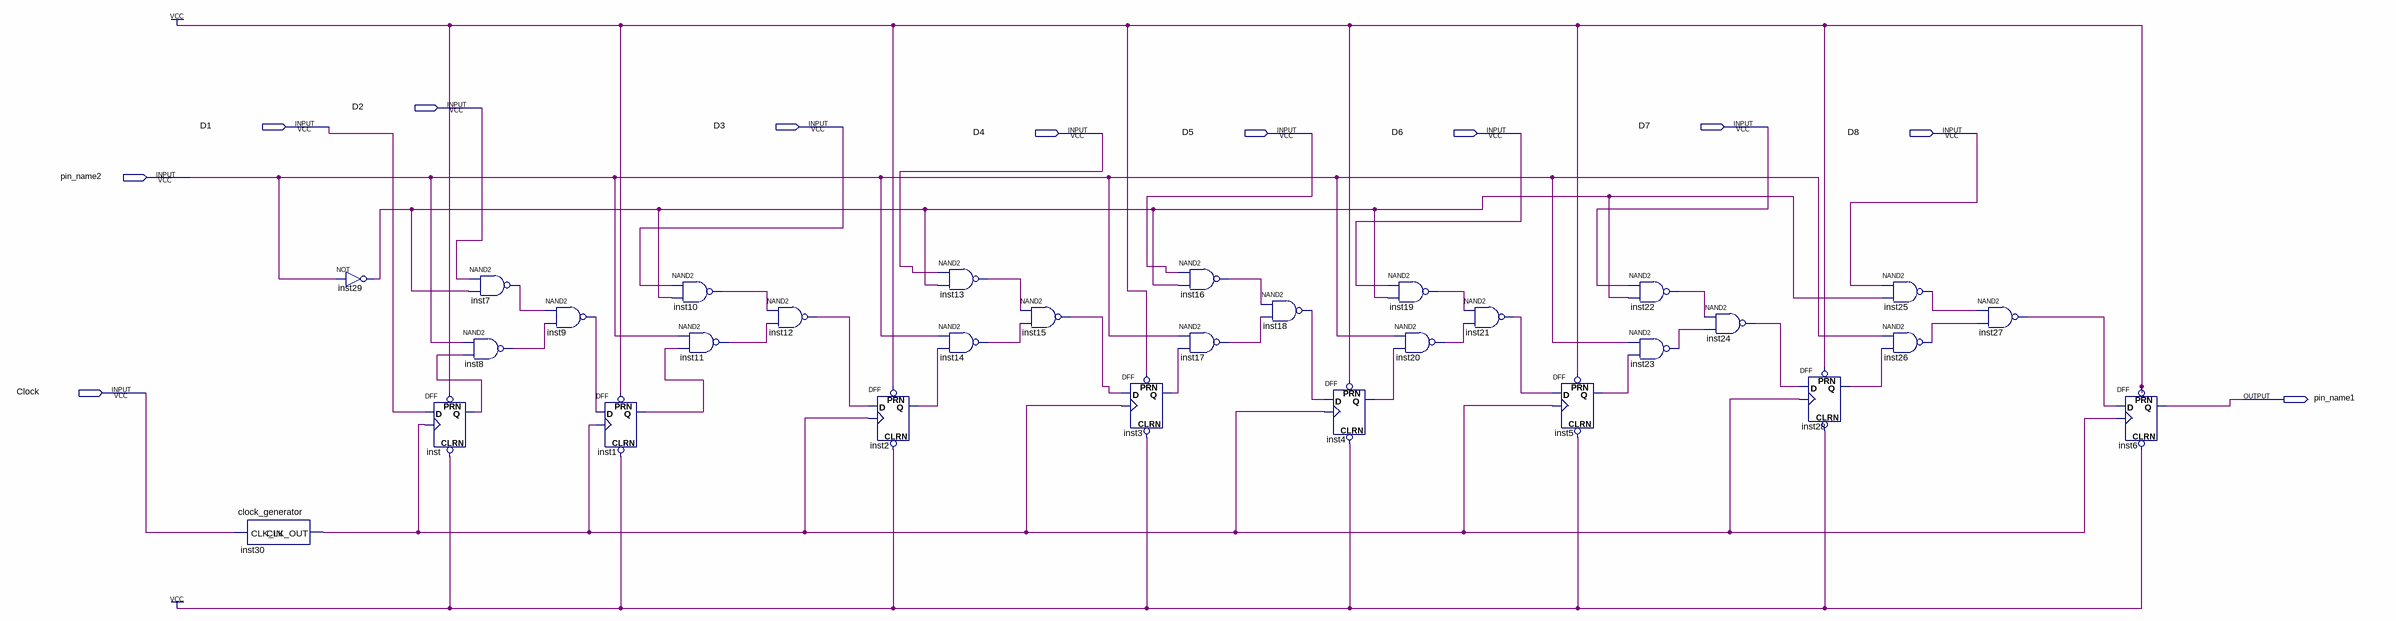
[diagram p0: schematic sheet]
// Quartus schematic serialshift1.bdf as structural Verilog: 31 symbols, 11 pins
module serialshift1 (
  input  D2,
  input  D1,
  input  D3,
  input  D7,
  input  D4,
  input  D5,
  input  D6,
  input  D8,
  input  pin_name2,
  input  Clock,
  output pin_name1
);

  wire inst1_q, inst2_q, inst3_q, inst4_q, inst5_q, inst7_out, inst8_out, inst9_out, inst10_out, inst11_out,
       inst12_out, inst13_out, inst14_out, inst15_out, inst16_out, inst17_out, inst18_out, inst19_out,
       inst20_out, inst21_out, inst22_out, inst23_out, inst24_out, inst25_out, inst26_out, inst27_out,
       inst28_q, inst29_out, inst30_clk_out, inst_q;

  clock_generator inst30 (.CLK_IN(Clock), .CLK_OUT(inst30_clk_out));
  not inst29 (inst29_out, pin_name2);
  DFF inst (.CLRN(1'b1), .CLK(inst30_clk_out), .D(D1), .PRN(1'b1), .Q(inst_q));
  nand inst7 (inst7_out, D2, inst29_out);
  nand inst8 (inst8_out, pin_name2, inst_q);
  nand inst9 (inst9_out, inst7_out, inst8_out);
  DFF inst1 (.CLRN(1'b1), .CLK(inst30_clk_out), .D(inst9_out), .PRN(1'b1), .Q(inst1_q));
  nand inst10 (inst10_out, D3, inst29_out);
  nand inst11 (inst11_out, pin_name2, inst1_q);
  nand inst12 (inst12_out, inst10_out, inst11_out);
  DFF inst2 (.CLRN(1'b1), .CLK(inst30_clk_out), .D(inst12_out), .PRN(1'b1), .Q(inst2_q));
  nand inst13 (inst13_out, D4, inst29_out);
  nand inst14 (inst14_out, pin_name2, inst2_q);
  nand inst15 (inst15_out, inst13_out, inst14_out);
  DFF inst3 (.CLRN(1'b1), .CLK(inst30_clk_out), .D(inst15_out), .PRN(1'b1), .Q(inst3_q));
  nand inst16 (inst16_out, D5, inst29_out);
  nand inst17 (inst17_out, pin_name2, inst3_q);
  nand inst18 (inst18_out, inst16_out, inst17_out);
  DFF inst4 (.CLRN(1'b1), .CLK(inst30_clk_out), .D(inst18_out), .PRN(1'b1), .Q(inst4_q));
  nand inst19 (inst19_out, D6, inst29_out);
  nand inst20 (inst20_out, pin_name2, inst4_q);
  nand inst21 (inst21_out, inst19_out, inst20_out);
  DFF inst5 (.CLRN(1'b1), .CLK(inst30_clk_out), .D(inst21_out), .PRN(1'b1), .Q(inst5_q));
  nand inst22 (inst22_out, D7, inst29_out);
  nand inst23 (inst23_out, pin_name2, inst5_q);
  nand inst24 (inst24_out, inst22_out, inst23_out);
  DFF inst28 (.CLRN(1'b1), .CLK(inst30_clk_out), .D(inst24_out), .PRN(1'b1), .Q(inst28_q));
  nand inst25 (inst25_out, D8, inst29_out);
  nand inst26 (inst26_out, pin_name2, inst28_q);
  nand inst27 (inst27_out, inst25_out, inst26_out);
  DFF inst6 (.CLRN(1'b1), .CLK(inst30_clk_out), .D(inst27_out), .PRN(1'b1), .Q(pin_name1));
endmodule
